# EAGLE design micropeak (EAGLE 9.6.2)
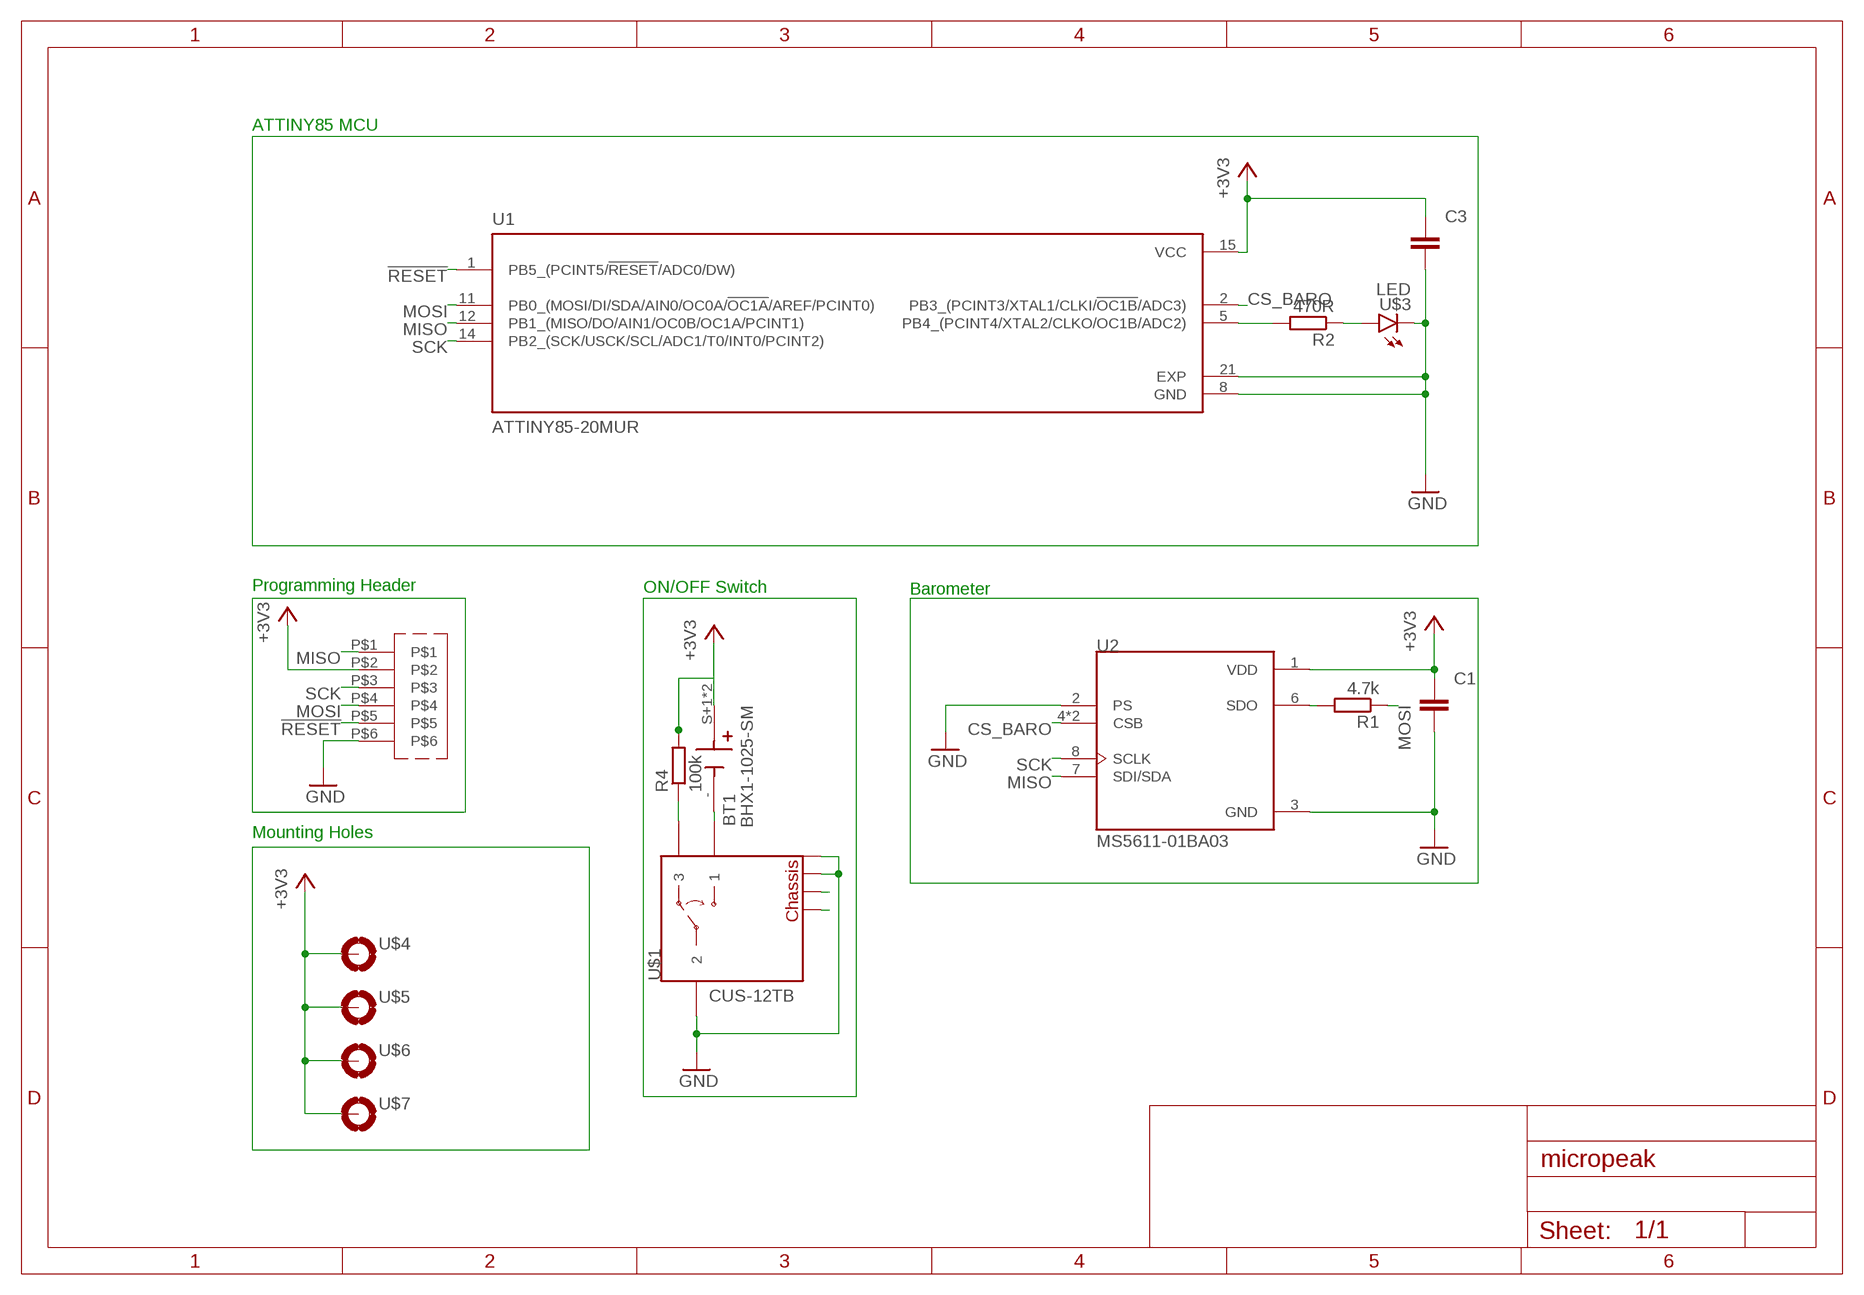
[diagram p0: schematic, sheet 1]

## Parts
BT1  BHX1-1025-SM  [BAT_BHX1-1025-SM]
C1  C-EUC0402  [C0402]
C3  C-EUC0402  [C0402]
R1  4.7k  R-EU_R0402  [R0402]
R2  470R  R-EU_R0402  [R0402]
R4  100k  R-EU_R0402  [R0402]
U1  ATTINY85-20MUR  [QFN50P400X400X80-21N]
U2  MS5611-01BA03  [SON125P500X300X100-8N]
U$1  CUS-12TB  [CUS-12B]
U$2  1X6_PROG_HEADER  [1X6_SMD_HEADER_PADS]
U$3  LED  [LED_LYT68B-T2V1-26-Z]
U$4  MOUNT_HOLE  [2,8-PAD]
U$5  MOUNT_HOLE  [2,8-PAD]
U$6  MOUNT_HOLE  [2,8-PAD]
U$7  MOUNT_HOLE  [2,8-PAD]

## Nets
!RESET!: U1.1(PB5_(PCINT5/!RESET!/ADC0/DW)) U$2.P$5
+3V3: BT1.S+1(+) BT1.S+2(+) C1.1 C3.1 R4.2 U1.15(VCC) U2.1(VDD) U$2.P$2 U$4.B2,8(MOUNT) U$5.B2,8(MOUNT) U$6.B2,8(MOUNT) U$7.B2,8(MOUNT)
CS_BARO: U1.2(PB3_(PCINT3/XTAL1/CLKI/!OC1B!/ADC3)) U2.4(CSB) U2.5(CSB)
GND: C1.2 C3.2 U1.8(GND) U1.21(EXP) U2.2(PS) U2.3(GND) U$1.P$2 U$1.P$4(GND) U$1.P$5(GND) U$2.P$6 U$3.C
MISO: U1.12(PB1_(MISO/DO/AIN1/OC0B/OC1A/PCINT1)) U2.7(SDI/SDA) U$2.P$1
MOSI: R1.1 U1.11(PB0_(MOSI/DI/SDA/AIN0/OC0A/!OC1A!/AREF/PCINT0)) U$2.P$4
N$1: BT1.- U$1.P$1
N$2: R4.1 U$1.P$3
N$3: R2.2 U1.5(PB4_(PCINT4/XTAL2/CLKO/OC1B/ADC2))
N$4: R2.1 U$3.A
N$5: R1.2 U2.6(SDO)
N$11: U$1.P$6(GND)
N$12: U$1.P$7(GND)
SCK: U1.14(PB2_(SCK/USCK/SCL/ADC1/T0/INT0/PCINT2)) U2.8(SCLK) U$2.P$3

## Notes on the sheet
- ATTINY85 MCU
- Programming Header | ON/OFF Switch | Barometer
- Mounting Holes

## Library data of the parts
BT1 = BHX1-1025-SM:BHX1-1025-SM: Holder Batt For 1025 Cell Smd Check availability <https://pricing.snapeda.com/parts/BHX1-1025-SM/MPD%20%28Memory%20Protection%20Devices%29/view-part?ref=eda>; AVAILABILITY: In Stock; DESCRIPTION: Battery Retainer Coin, 10.0mm 1 Cell SMD (SMT) Tab; MF: MPD (Memory Protection Devices); MP: BHX1-1025-SM; PACKAGE: None; PRICE: None; PURCHASE-URL: https://pricing.snapeda.com/search/part/BHX1-1025-SM/?ref=eda
C1 C3 = rcl:C-EU: CAPACITOR, European symbol; SPICEPREFIX: C
R1 R2 R4 = rcl:R-EU_: RESISTOR, European symbol; SPICEPREFIX: R
U1 = ATTINY85-20MUR:ATTINY85-20MUR: AVR AVR® ATtiny Microcontroller IC 8-Bit 20MHz 8KB (4K x 16) FLASH 20-QFN-EP (4x4) Check availability <https://pricing.snapeda.com/parts/ATTINY85-20MUR/Microchip%20Technology/view-part?ref=eda>; AVAILABILITY: In Stock; DESCRIPTION: AVR AVR® ATtiny, Functional Safety (FuSa) Microcontroller IC 8-Bit 20MHz 8KB (4K x 16) FLASH 20-QFN-EP (4x4); MF: Microchip Technology; MP: ATTINY85-20MUR; PACKAGE: QFN-20 Microchip; PRICE: None; PURCHASE-URL: https://pricing.snapeda.com/search/part/ATTINY85-20MUR/?ref=eda
U2 = MS5611-01BA03:MS5611-01BA03: Barometric Pressure Sensor, with stainless steel cap Check availability <https://pricing.snapeda.com/parts/MS5611-01BA03/TE%20Connectivity/view-part?ref=eda>; AVAILABILITY: In Stock; COMMENT: CAT-BLPS0036; DESCRIPTION: Pressure Sensor 0.15PSI ~ 17.4PSI (1kPa ~ 120kPa) Absolute - 24 b 8-SMD; MF: TE Connectivity; MP: MS5611-01BA03; PACKAGE: SMD-8 Measurement Specialties; PRICE: None; PURCHASE-URL: https://pricing.snapeda.com/search/part/MS5611-01BA03/?ref=eda
U$1 = CUS-12TB:CUS-12TB: Check availability <https://pricing.snapeda.com/parts/CUS-12TB/Nidec%20Copal/view-part?ref=eda>; AVAILABILITY: In Stock; DESCRIPTION: Slide Switch SPDT Surface Mount, Right Angle; MF: Nidec Copal; MP: CUS-12TB; PACKAGE: None; PRICE: None; PURCHASE-URL: https://pricing.snapeda.com/search/part/CUS-12TB/?ref=eda
U$2 = 1x6_prog_header:1X6_PROG_HEADER
U$3 = LED_LYT68B-T2V1-26-Z:LED
U$4-U$7 = LED_LYT68B-T2V1-26-Z:MOUNT_HOLE

## Board
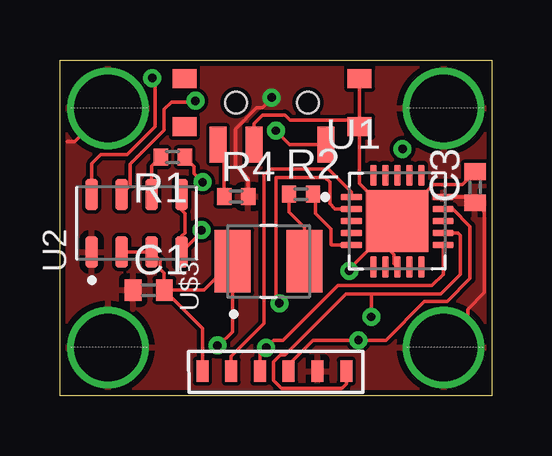
[diagram p1: board, top side]
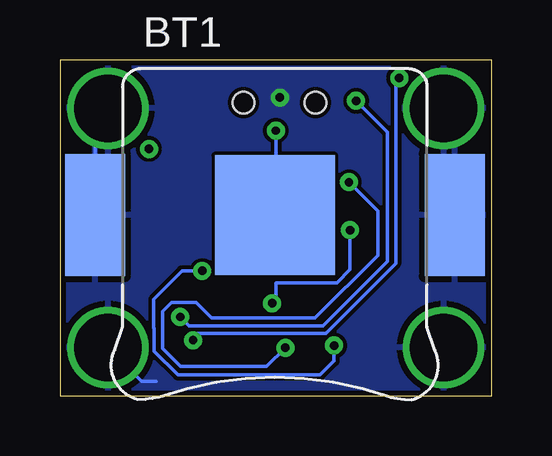
[diagram p2: board, bottom side, seen from below]

Size 18 x 14 mm. Coordinates in mm from the lower left corner, seen from the top.
Outline: 0,0 0,14 18,14 18,0 0,0
Copper layers (1*16): Top 0.035mm / dielectric 1.5mm / Bottom 0.035mm
Design rules "default *": minimum track width 0.003809375mm, minimum drill 0.2mm, track to track 0.15mm, track to pad 0.15mm, pad to pad 0.15mm, via to via 0.15mm, smd to smd 6mil, copper to edge 0.2mm, drill to drill 6mil, minimum pad ring 0.3mm, minimum via ring 0.2mm, stop-mask expansion 4mil, vias tented up to drill 0mil, thermal gap 10mil

### Footprints (pad centres in the part's own frame; a part is rotated, then mirrored left to right if it is on the bottom)
BAT_BHX1-1025-SM = smd 5 x 5: - 0,0 | smd 2.5 x 5.1: S+1 -7.5,0; S+2 7.5,0
C0402 = smd 0.7 x 0.9: 1 -0.65,0; 2 0.65,0
R0402 = smd 0.6 x 0.7: 1 -0.5,0; 2 0.5,0
QFN50P400X400X80-21N = smd 0.89 x 0.26: 1 -1.91,1; 2 -1.91,0.5; 3 -1.91,0; 4 -1.91,-0.5; 5 -1.91,-1; 11 1.91,-1; 12 1.91,-0.5; 13 1.91,0; 14 1.91,0.5; 15 1.91,1 | smd 0.26 x 0.89: 6 -1,-1.91; 7 -0.5,-1.91; 8 0,-1.91; 9 0.5,-1.91; 10 1,-1.91; 16 1,1.91; 17 0.5,1.91; 18 0,1.91; 19 -0.5,1.91; 20 -1,1.91 | smd 2.6 x 2.6: 21 0,0
SON125P500X300X100-8N = smd 1.31 x 0.53: 1 -1.2,1.875; 2 -1.2,0.625; 3 -1.2,-0.625; 4 -1.2,-1.875; 5 1.2,-1.875; 6 1.2,-0.625; 7 1.2,0.625; 8 1.2,1.875
CUS-12B = smd 0.7 x 1.5: P$1 -2.25,1.75; P$2 0.75,1.75; P$3 2.25,1.75 | smd 1 x 0.8: P$4 -3.65,1; P$5 -3.65,-1; P$6 3.65,-1; P$7 3.65,1 | hole 0.9: -1.5,0; 1.5,0
1X6_SMD_HEADER_PADS = smd 0.9 x 0.5: P$1 0,0; P$2 0,-1.2; P$3 0,-2.4; P$4 0,-3.6; P$5 0,-4.8; P$6 0,-6
LED_LYT68B-T2V1-26-Z = smd 2.6 x 1.5: A 0,-1.5; C 0,1.5
2,8-PAD = drill 2.8 pad 3.1: B2,8 0,0

### Placement (x,y rotation side)
BT1  9.04,7.53 0 bottom
C1  3.7,4.4 0 top
C3  17.31,8.69 90 top
R1  [R0402]  4.7,9.95 180 top
R2  [R0402]  10.05,8.4 0 top
R4  [R0402]  7.35,8.3 0 top
U1  14.07,7.28 0 top
U2  3.2,7.19 90 top
U$1  8.84,12.22 180 top
U$2  11.94,1.02 270 top
U$3  8.7,5.6 90 top
U$4  2,2 0 top
U$5  16,2 0 top
U$6  16,11.98 0 top
U$7  2,11.98 0 top

### Tracks (layer width: path | path; a pad name or v marks a point on that pad's centre or on a via)
!RESET!
  Top 0.152: U$2.P$5 7.14,1.64 8.5,3 8.5,9.2 8.75,9.45 11.2,9.45 12.16,8.49 U1.1
+3V3  (via drill 0.35 pad 0.4)
  Top 0.152: U1.15 17.06,8.29 C3.1 17.7,7.65 17.7,4.3 17,3.6 17,3 U$5.B2,8 | U$7.B2,8 0.62,10.6 0.3,10.6 | R4.2 7.85,9.07 7.32,9.6 7.32,11.12 8.2,12 8.44,12 8.85,12.41 v8.83,12.43
  Bottom 0.152: U$5.B2,8 14.6,0.6 14,0.6 | v8.83,12.43 9,12.6 | BT1.S+1 16.54,11.44 U$6.B2,8
  pour Top: 0,14 18,14 18,0 0,0
  pour Bottom: 0,14 18,14 18,0 0,0
CS_BARO  (via drill 0.35 pad 0.4)
  Top 0.152: U2.5 5.08,7.74 5.21,7.6 5.21,6.78 5.08,6.65 U2.4 5.9,6.81 v5.9,6.9 | U1.2 11.47,7.78 11.25,8 11.25,8.9 11.05,9.1 9.01,9.1 9.01,3.99 v9.15,3.85
  Bottom 0.152: v5.9,6.9 5.9,5.25 6.45,4.7 9,4.7 9,4 v9.15,3.85
GND  (via drill 0.35 pad 0.4)
  Top 0.152: U$2.P$6 5.94,2.81 C1.2 | C1.2 6,4.4 U$3.C | 8.02,10.47 U$1.P$2 8.09,11.34 8.45,11.7 9.38,11.7 9.59,11.49 12.22,11.49 U$1.P$4 | U$1.P$4 U$1.P$5 | U$1.P$4 12.49,8.85 14.06,7.28 U1.21 | C1.2 4.35,5.12 4.19,5.28 4.19,5.63 U2.3 U2.2 | U$3.C 7.2,4.39 | U$3.C 7.2,2.66 6.62,2.08 v6.57,2.08 | U1.21 13.7,6.9 | 13.7,6.9 12.06,5.28 v12.06,5.2 | C3.2 16.78,8.81 15.57,8.81 14.07,7.31 | 14.07,7.31 13.83,7.07 | U1.8 13.93,5.51 13.93,5.89 13.7,6.12 13.7,6.9 | U1.21 14.07,7.31
  Bottom 0.152: v12.06,5.2 12.91,5.2 14.09,4.02 14.09,2.81 14.07,2.8 14.07,1.85 13.08,0.86 7.15,0.86 6.57,1.44 v6.57,2.08
MISO  (via drill 0.35 pad 0.4)
  Top 0.152: U1.12 16.6,6.78 16.7,6.68 16.7,5.05 15.89,4.24 12.98,4.24 | 12.98,4.24 11.92,4.24 9.38,1.7 9.2,1.7 8.9,1.4 8.9,0.64 9.24,0.3 11.75,0.3 11.94,0.49 U$2.P$1 | U2.7 2.94,8.75 2.94,9.66 4.35,11.07 4.35,11.95 4.65,12.25 5.65,12.25 v5.65,12.29 | v12.98,3.28 12.98,4.24
  Bottom 0.152: v5.65,12.29 4.35,10.99 4.35,5.6 7.04,2.91 12.61,2.91 v12.98,3.28
MOSI  (via drill 0.35 pad 0.4)
  Top 0.152: U1.11 15.98,5.06 15.52,4.6 11.6,4.6 9.3,2.3 8.9,2.3 v8.6,2 8.34,1.74 U$2.P$4 | R1.1 5.6,9.55 5.6,9.25 v5.95,8.9
  Bottom 0.152: v5.95,8.9 4.75,7.7 4.75,5.85 7.36,3.24 11.68,3.24 12.32,3.88 13.34,3.88 13.71,3.51 13.71,1.97 12.96,1.22 9.38,1.22 v8.6,2
N$1  (via drill 0.35 pad 0.4)
  Top 0.152: v9,11.05 9.58,10.47 U$1.P$1
  Bottom 0.152: v9,11.05 9,7.57 BT1.-
N$2
  Top 0.152: U$1.P$3 6.85,10.21 R4.1
N$3
  Top 0.152: R2.2 10.65,8.3 10.65,7.6 11.3,6.95 11.3,6.3 11.32,6.28 U1.5
N$4
  Top 0.152: U$3.A 10.2,7 9.55,7.65 R2.1
N$5
  Top 0.152: R1.2 3.83,9.57 U2.6
N$13  (via drill 0.35)
  other vias: 14.29,10.29
SCK  (via drill 0.35 pad 0.4)
  Top 0.152: U1.14 16.38,7.78 17.1,7.06 17.1,4.88 16.15,3.93 15.2,3.93 13.59,2.31 v12.45,2.31 10.56,2.31 9.54,1.29 U$2.P$3 | U2.8 1.33,9.67 1.7,10.05 2.8,10.05 3.96,11.21 3.96,13.14 v3.85,13.25
  Bottom 0.152: v3.85,13.25 3.85,13.05 4,12.9 4,5.5 6.9,2.6 12.45,2.6 v12.45,2.31